# Altium schematic sheet prim_analog_in.SchDoc: foxBMS BMS-Slave 12-Cell
size A3; DocumentNumber: 10; SheetNumber: 10; SheetTotal: 21; AUTHOR: Fraunhofer IISB foxBMS Team; SheetDescription: Primary Analog Inputs
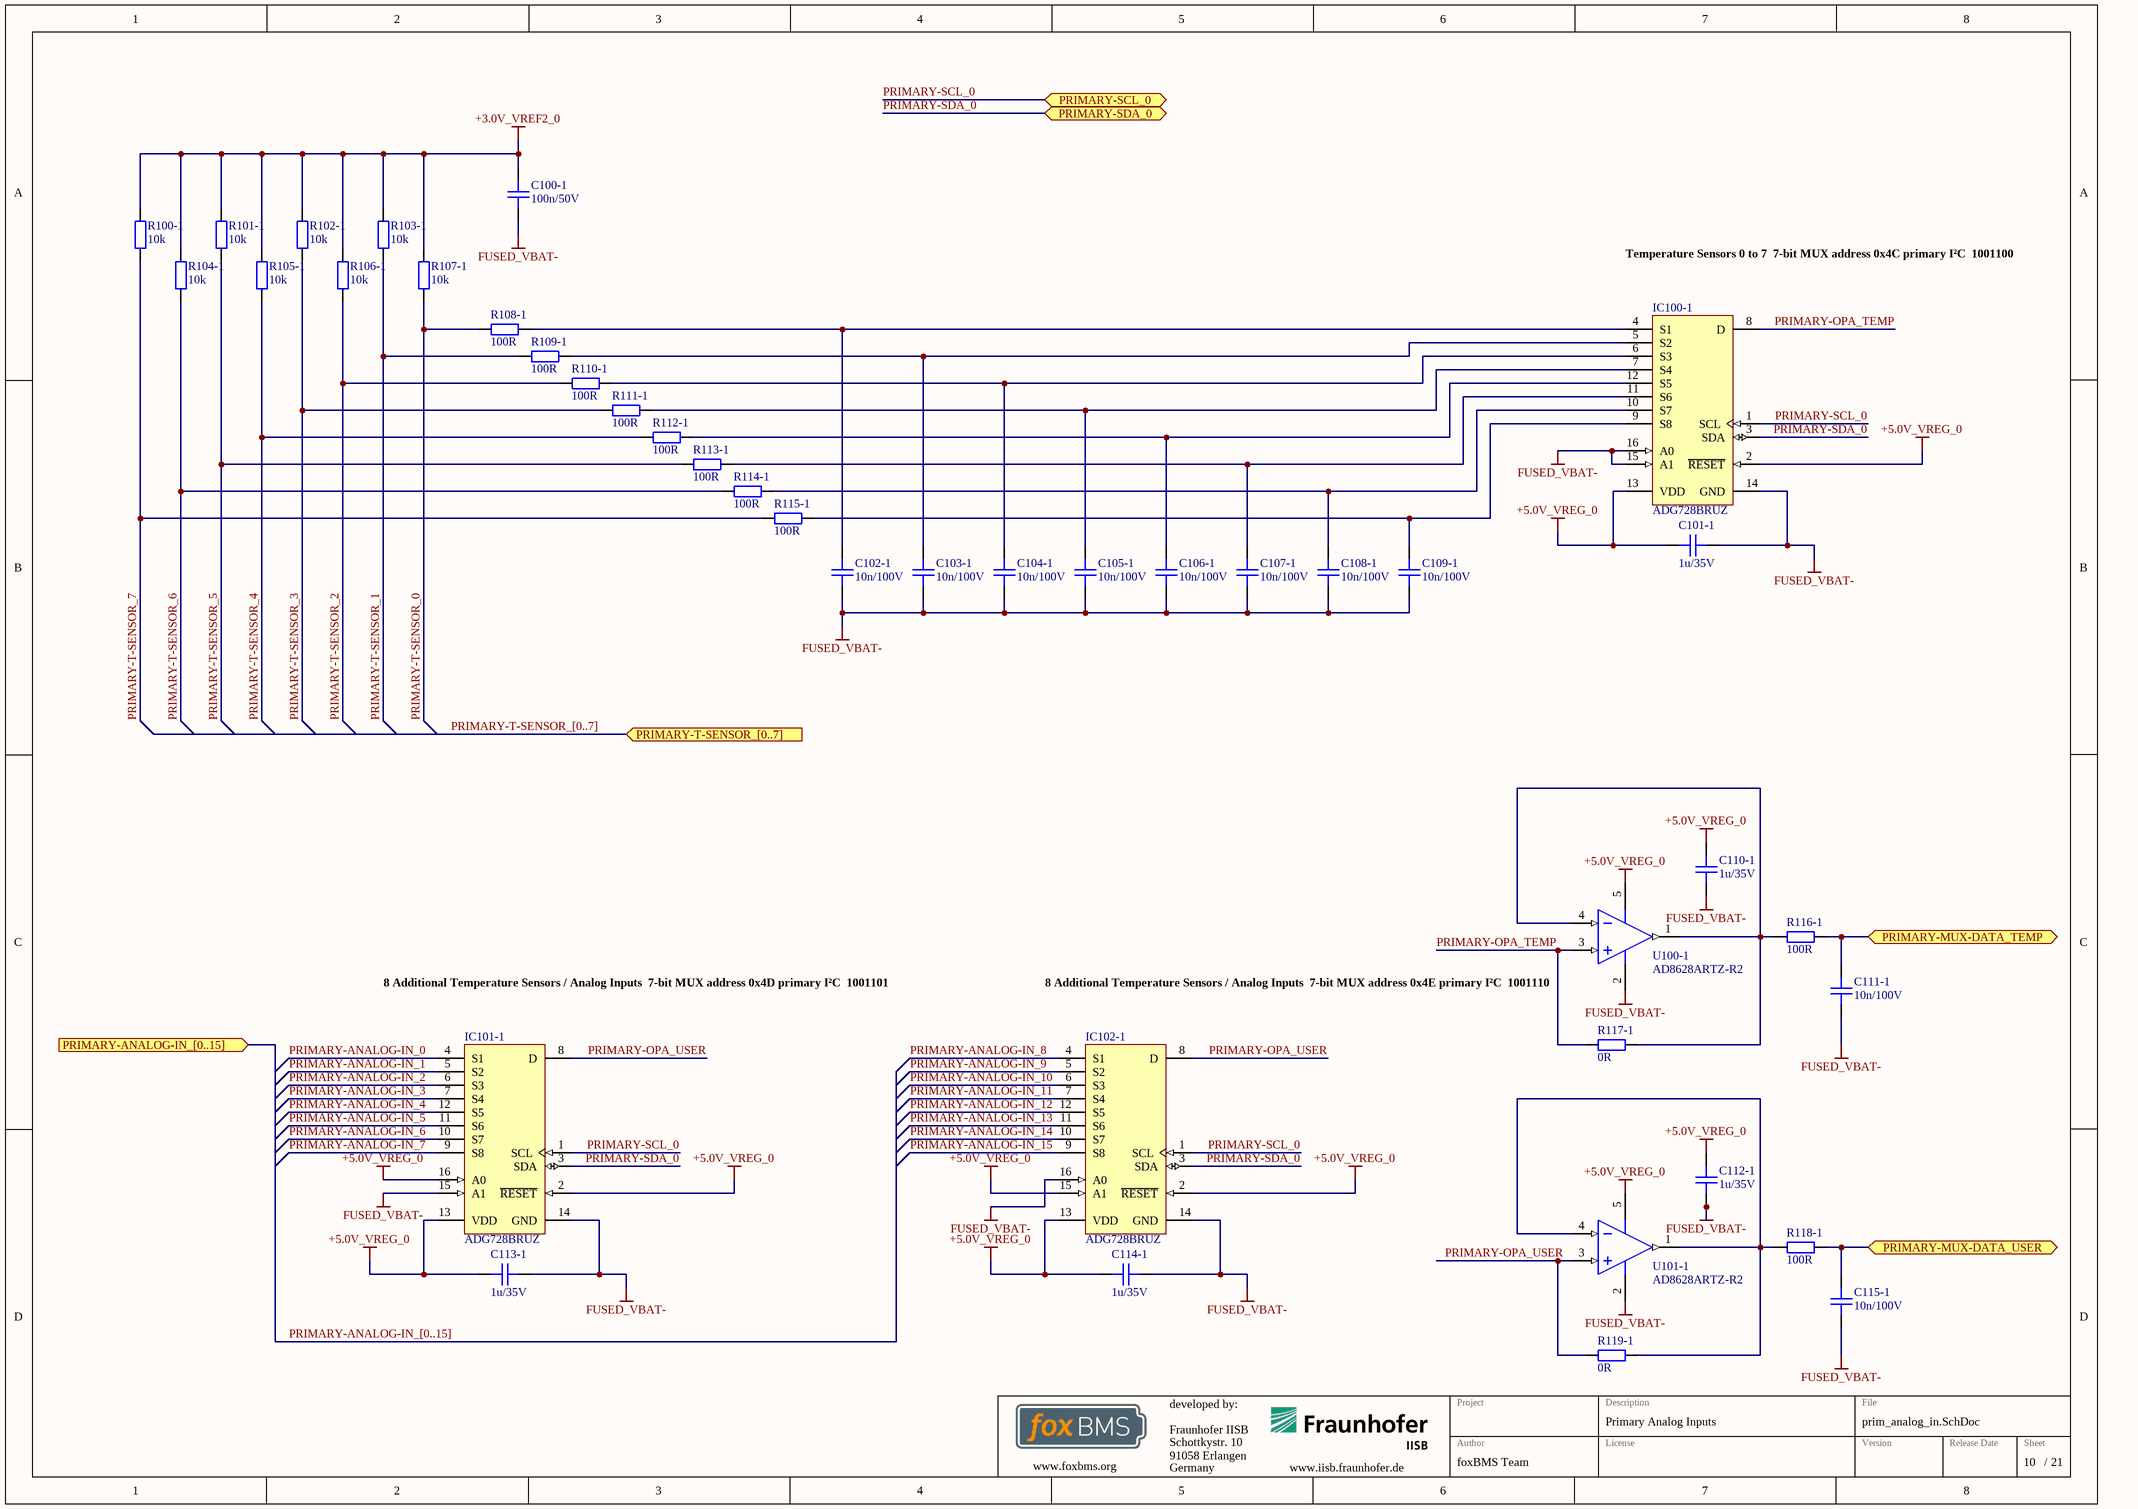
[diagram p0: prim_analog_in.SchDoc]

## Parts
C100-1  100n/50V  [CAPC1608X08N]
C101-1  1u/35V  [CAPC1608X08N]
C102-1  10n/100V  [CAPC1608X08N]
C103-1  10n/100V  [CAPC1608X08N]
C104-1  10n/100V  [CAPC1608X08N]
C105-1  10n/100V  [CAPC1608X08N]
C106-1  10n/100V  [CAPC1608X08N]
C107-1  10n/100V  [CAPC1608X08N]
C108-1  10n/100V  [CAPC1608X08N]
C109-1  10n/100V  [CAPC1608X08N]
C110-1  1u/35V  [CAPC1608X08N]
C111-1  10n/100V  [CAPC1608X08N]
C112-1  1u/35V  [CAPC1608X08N]
C113-1  1u/35V  [CAPC1608X08N]
C114-1  1u/35V  [CAPC1608X08N]
C115-1  10n/100V  [CAPC1608X08N]
IC100-1  ADG728BRUZ  [ADI-RU-16_M]
IC101-1  ADG728BRUZ  [ADI-RU-16_M]
IC102-1  ADG728BRUZ  [ADI-RU-16_M]
R100-1  10k  [RESC1608X05N]
R101-1  10k  [RESC1608X05N]
R102-1  10k  [RESC1608X05N]
R103-1  10k  [RESC1608X05N]
R104-1  10k  [RESC1608X05N]
R105-1  10k  [RESC1608X05N]
R106-1  10k  [RESC1608X05N]
R107-1  10k  [RESC1608X05N]
R108-1  100R  [RESC1608X05N]
R109-1  100R  [RESC1608X05N]
R110-1  100R  [RESC1608X05N]
R111-1  100R  [RESC1608X05N]
R112-1  100R  [RESC1608X05N]
R113-1  100R  [RESC1608X05N]
R114-1  100R  [RESC1608X05N]
R115-1  100R  [RESC1608X05N]
R116-1  100R  [RESC1608X05N]
R117-1  0R  [RESC1608X05N]
R118-1  100R  [RESC1608X05N]
R119-1  0R  [RESC1608X05N]
U100-1  AD8628ARTZ-R2  [ADI-RJ-5_M]
U101-1  AD8628ARTZ-R2  [ADI-RJ-5_M]

## Ports
PRIMARY-ANALOG-IN_[0..15] (in), PRIMARY-MUX-DATA_TEMP (bidir), PRIMARY-MUX-DATA_USER (bidir), PRIMARY-SCL_0 (bidir), PRIMARY-SDA_0 (bidir), PRIMARY-T-SENSOR_[0..7] (in)

## Nets
+3.0V_VREF2_0: C100-1.2 R100-1.2 R101-1.2 R102-1.2 R103-1.2 R104-1.2 R105-1.2 R106-1.2 R107-1.2
+5.0V_VREG_0: C101-1.2 C110-1.2 C112-1.2 C113-1.2 C114-1.2 IC100-1.2(~{RESET}) IC100-1.13(VDD) IC101-1.2(~{RESET}) IC101-1.13(VDD) IC101-1.16(A0) IC102-1.2(~{RESET}) IC102-1.13(VDD) IC102-1.15(A1) U100-1.5(+V) U101-1.5(+V)
FUSED_VBAT-: C100-1.1 C101-1.1 C102-1.1 C103-1.1 C104-1.1 C105-1.1 C106-1.1 C107-1.1 C108-1.1 C109-1.1 C110-1.1 C111-1.1 C112-1.1 C113-1.1 C114-1.1 C115-1.1 IC100-1.14(GND) IC100-1.15(A1) IC100-1.16(A0) IC101-1.14(GND) IC101-1.15(A1) IC102-1.14(GND) IC102-1.16(A0) U100-1.2(-V) U101-1.2(-V)
PRIMARY-ANALOG-IN_0: IC101-1.4(S1)
PRIMARY-ANALOG-IN_1: IC101-1.5(S2)
PRIMARY-ANALOG-IN_2: IC101-1.6(S3)
PRIMARY-ANALOG-IN_3: IC101-1.7(S4)
PRIMARY-ANALOG-IN_4: IC101-1.12(S5)
PRIMARY-ANALOG-IN_5: IC101-1.11(S6)
PRIMARY-ANALOG-IN_6: IC101-1.10(S7)
PRIMARY-ANALOG-IN_7: IC101-1.9(S8)
PRIMARY-ANALOG-IN_8: IC102-1.4(S1)
PRIMARY-ANALOG-IN_9: IC102-1.5(S2)
PRIMARY-ANALOG-IN_10: IC102-1.6(S3)
PRIMARY-ANALOG-IN_11: IC102-1.7(S4)
PRIMARY-ANALOG-IN_12: IC102-1.12(S5)
PRIMARY-ANALOG-IN_13: IC102-1.11(S6)
PRIMARY-ANALOG-IN_14: IC102-1.10(S7)
PRIMARY-ANALOG-IN_15: IC102-1.9(S8)
PRIMARY-MUX-DATA_TEMP: C111-1.2 R116-1.2 ; port PRIMARY-MUX-DATA_TEMP
PRIMARY-MUX-DATA_USER: C115-1.2 R118-1.2 ; port PRIMARY-MUX-DATA_USER
PRIMARY-OPA_TEMP: IC100-1.8(D) R117-1.1 U100-1.3(+IN)
PRIMARY-OPA_USER: IC101-1.8(D) IC102-1.8(D) R119-1.1 U101-1.3(+IN)
PRIMARY-SCL_0: IC100-1.1(SCL) IC101-1.1(SCL) IC102-1.1(SCL) ; port PRIMARY-SCL_0
PRIMARY-SDA_0: IC100-1.3(SDA) IC101-1.3(SDA) IC102-1.3(SDA) ; port PRIMARY-SDA_0
PRIMARY-T-SENSOR_0: R107-1.1 R108-1.2
PRIMARY-T-SENSOR_1: R103-1.1 R109-1.2
PRIMARY-T-SENSOR_2: R106-1.1 R110-1.2
PRIMARY-T-SENSOR_3: R102-1.1 R111-1.2
PRIMARY-T-SENSOR_4: R105-1.1 R112-1.2
PRIMARY-T-SENSOR_5: R101-1.1 R113-1.2
PRIMARY-T-SENSOR_6: R104-1.1 R114-1.2
PRIMARY-T-SENSOR_7: R100-1.1 R115-1.2
NetC102-1_2: C102-1.2 IC100-1.4(S1) R108-1.1
NetC103-1_2: C103-1.2 IC100-1.5(S2) R109-1.1
NetC104-1_2: C104-1.2 IC100-1.6(S3) R110-1.1
NetC105-1_2: C105-1.2 IC100-1.7(S4) R111-1.1
NetC106-1_2: C106-1.2 IC100-1.12(S5) R112-1.1
NetC107-1_2: C107-1.2 IC100-1.11(S6) R113-1.1
NetC108-1_2: C108-1.2 IC100-1.10(S7) R114-1.1
NetC109-1_2: C109-1.2 IC100-1.9(S8) R115-1.1
NetR116-1_1: R116-1.1 R117-1.2 U100-1.1(OUT) U100-1.4(-IN)
NetR118-1_1: R118-1.1 R119-1.2 U101-1.1(OUT) U101-1.4(-IN)

## Buses and harness runs
bus PRIMARY-ANALOG-IN_[0..15] = port PRIMARY-ANALOG-IN_[0..15]
bus PRIMARY-T-SENSOR_[0..7] = port PRIMARY-T-SENSOR_[0..7]

## Notes on the sheet
- Temperature Sensors 0 to 7
  7-bit MUX address 0x4C primary I²C
  1001100
- 8 Additional Temperature Sensors / Analog Inputs
  7-bit MUX address 0x4D primary I²C
  1001101
- (near U100-1) 8 Additional Temperature Sensors / Analog Inputs
  7-bit MUX address 0x4E primary I²C
  1001110
- Fraunhofer IISB
- Schottkystr. 10
- developed by:
- 91058 Erlangen
- Germany
- Author
- Project
- License
- Description
- File
- Version
- Release Date
- Sheet
- www.foxbms.org
- www.iisb.fraunhofer.de
- foxBMS Team
- /

## Library data of the parts
C100-1 = gen_C_ceramic_100n_50V_X7R_0603: MLCC; Capacitance: 100n; Rated Voltage: 50V; Dielectric: X7R; Case EIA: 0603; Case Metric: 1608; PnP Package: C_0603_10; PnP Value: 100n/50V/X7R; PnP equipped: x; Automotive Qualified: True; Part Number: gen_C_ceramic_100n_50V_X7R_0603; Supplier 1: Farnell; Supplier Part Number 1: 2525267; Supplier 2: Digikey; Supplier Part Number 2: 490-6049-1-ND; Supplier 3: Farnell; Supplier Part Number 3: 2070398
C101-1 C110-1 C112-1 C113-1 C114-1 = gen_C_ceramic_1u_35V_X7R_0603: MLCC; Capacitance: 1u; Rated Voltage: 35V; Dielectric: X7R; Case EIA: 0603; Case Metric: 1608; PnP Package: C_0603_10; PnP Value: 1uF/35V/X7R; PnP equipped: x; Automotive Qualified: False; Part Number: gen_C_ceramic_1u_35V_X7R_0603; Supplier 1: Farnell; Supplier Part Number 1: 1907508
C102-1 C103-1 C104-1 C105-1 C106-1 C107-1 C108-1 C109-1 C111-1 C115-1 = gen_C_ceramic_10n_100V_X7R_0603: MLCC; Capacitance: 10n; Rated Voltage: 100V; Dielectric: X7R; Case EIA: 0603; Case Metric: 1608; Automotive Qualified: True; PnP Package: C_0603_10; PnP Value: 10n/100V/X7R; Part Number: gen_C_ceramic_10n_100V_X7R_0603; Supplier 1: Farnell; Supplier Part Number 1: 1301715; Supplier 2: Farnell; Supplier Part Number 2: 2821192; Supplier 3: Farnell; Supplier Part Number 3: 2210878
IC100-1 IC101-1 IC102-1 = CMP-0798-00197-1: CMOS, Low Voltage, 2-Wire Serially Controlled, Matrix Switch, -40 to 85 degC, 16-pin SOP (RU-16), Tube; Manufacturer: Analog Devices; Ron (ohms): 2.5; Supply V Guar Performance: Single_(+3V), Single_(+5V); Max Analog Signal Range: 0 to Vdd; Bandwidth (Hz): 65M; ComponentLink3Description: Package Specification; Packing: Tube; PartNumber: ADG728BRUZ; ComponentLink1URL: http://www.analog.com/en/index.html; Mounting Technology: Surface Mount; DatasheetVersion: Rev. C; ComponentLink1Description: Manufacturer URL; ComponentLink3URL: http:/www.analog.com/static/imported-files/packages/36244347913743854010197452789RU16.pdf; ComponentLink2URL: http://www.analog.com/static/imported-files/data_sheets/ADG728_729.pdf; PackageVersion: Nov-02; PackageDescription: 16-Pin Thin Shrink Small Outline Package, Body 5 x 4.4 mm, Pitch 0.65 mm; Code_JEDEC: MO-153AB; PackageReference: RU-16; ComponentLink2Description: Datasheet
R100-1 R101-1 R102-1 R103-1 R104-1 R105-1 R106-1 R107-1 = gen_R_10k_0603: SMD Resistor 10k 0603; Tolerance: 1%; Power: 0.1W; Case EIA: 0603; Case Metric: 1608; Maximum Working Voltage: 75V; PnP Package: R_0603; Automotive Qualified: True; Part Number: gen_R_10k_0603; Operating Temperature: -55°C - +155°C; Resistance: 10k; Series: E24, E96; PnP Value: 10k; Supplier 1: Farnell; Supplier Part Number 1: 2073349
R108-1 R109-1 R110-1 R111-1 R112-1 R113-1 R114-1 R115-1 = gen_R_100R_0603: SMD Resistor 100R 0603; Tolerance: 1%; Power: 0.1W; Case EIA: 0603; Case Metric: 1608; Maximum Working Voltage: 75V; PnP Package: R_0603; Automotive Qualified: True; Part Number: gen_R_100R_0603; Operating Temperature: -55°C - +155°C; Resistance: 100R; Series: E24, E96; PnP Value: 100R; Supplier 1: Digikey; Supplier Part Number 1: P100HCT-ND
R116-1 R118-1 = gen_R_100R_0603: SMD Resistor 100R 0603; Tolerance: 1%; Power: 0.1W; Case EIA: 0603; Case Metric: 1608; Maximum Working Voltage: 75V; PnP Package: R_0603; Automotive Qualified: False; Part Number: gen_R_100R_0603; Operating Temperature: -55°C - +155°C; Resistance: 100R; Series: E24, E96; PnP Value: 100R; Supplier 1: Farnell; Supplier Part Number 1: 1469752
R117-1 R119-1 = gen_R_0R_0603: SMD Resistor 0R 0603; Power: 0.1W; Case EIA: 0603; Case Metric: 1608; Maximum Working Voltage: 75V; PnP Package: R_0603; Automotive Qualified: True; Part Number: gen_R_0R_0603; Operating Temperature: -55°C - +155°C; Resistance: 0R; Series: Jumper; PnP Value: 0R; Supplier 1: Farnell; Supplier Part Number 1: 2616580
U100-1 U101-1 = CMP-0384-01512-2: Single Channel RRIO Operational Amplifier, 2.5 MHz BW, 1 V/us SR, Industrial, 5-pin SOT23 (RJ-5), Reel; Manufacturer: Analog Devices; Generic Part Number: AD8628; Iq/Amp: 1.1mA; Automotive Qualified: Yes; V Span Max: 6V; Input Bias Current: 30pA; Slew Rate: 1V/us; Amplifiers Per Package: 1; Input Offset Voltage: 1uV; Small Signal Bandwidth: 2.5MHz; V Span Min: 2.7V; ComponentLink1Description: Manufacturer URL; DatasheetVersion: Rev. I; ComponentLink4Description: Reference Circuit; Code_JEDEC: MO-178-AA; PackageDescription: 5-Pin Small Outline Transistor Package, Body 2.9 x 1.6 mm, Pitch 0.95 mm; ComponentLink3URL: http://www.analog.com/static/imported-files/packages/PKG_PDF/SOT-23(RJ)/RJ_5.pdf; PackageReference: RJ-5; ComponentLink1URL: http://www.analog.com/en/index.html; PackageVersion: 121608-A; RevisionNote: Reference Circuit URL fixed; Mounting Technology: Surface Mount; ComponentLink2Description: Datasheet; ComponentLink3Description: Package Specification; ComponentLink4URL: http://www.analog.com/en/all-operational-amplifiers-op-amps/operational-amplifiers-op-amps/ad8628/products/product.html#product-recommendations; ComponentLink2URL: http://www.analog.com/static/imported-files/data_sheets/AD8628_8629_8630.pdf; PartNumber: AD8628ARTZ-R2